# Altium schematic sheet [01] cover page.SchDoc
size A4; Organization: Blinkinlabs, LLC; DocumentNumber: 1; SheetNumber: 1; SheetTotal: 4
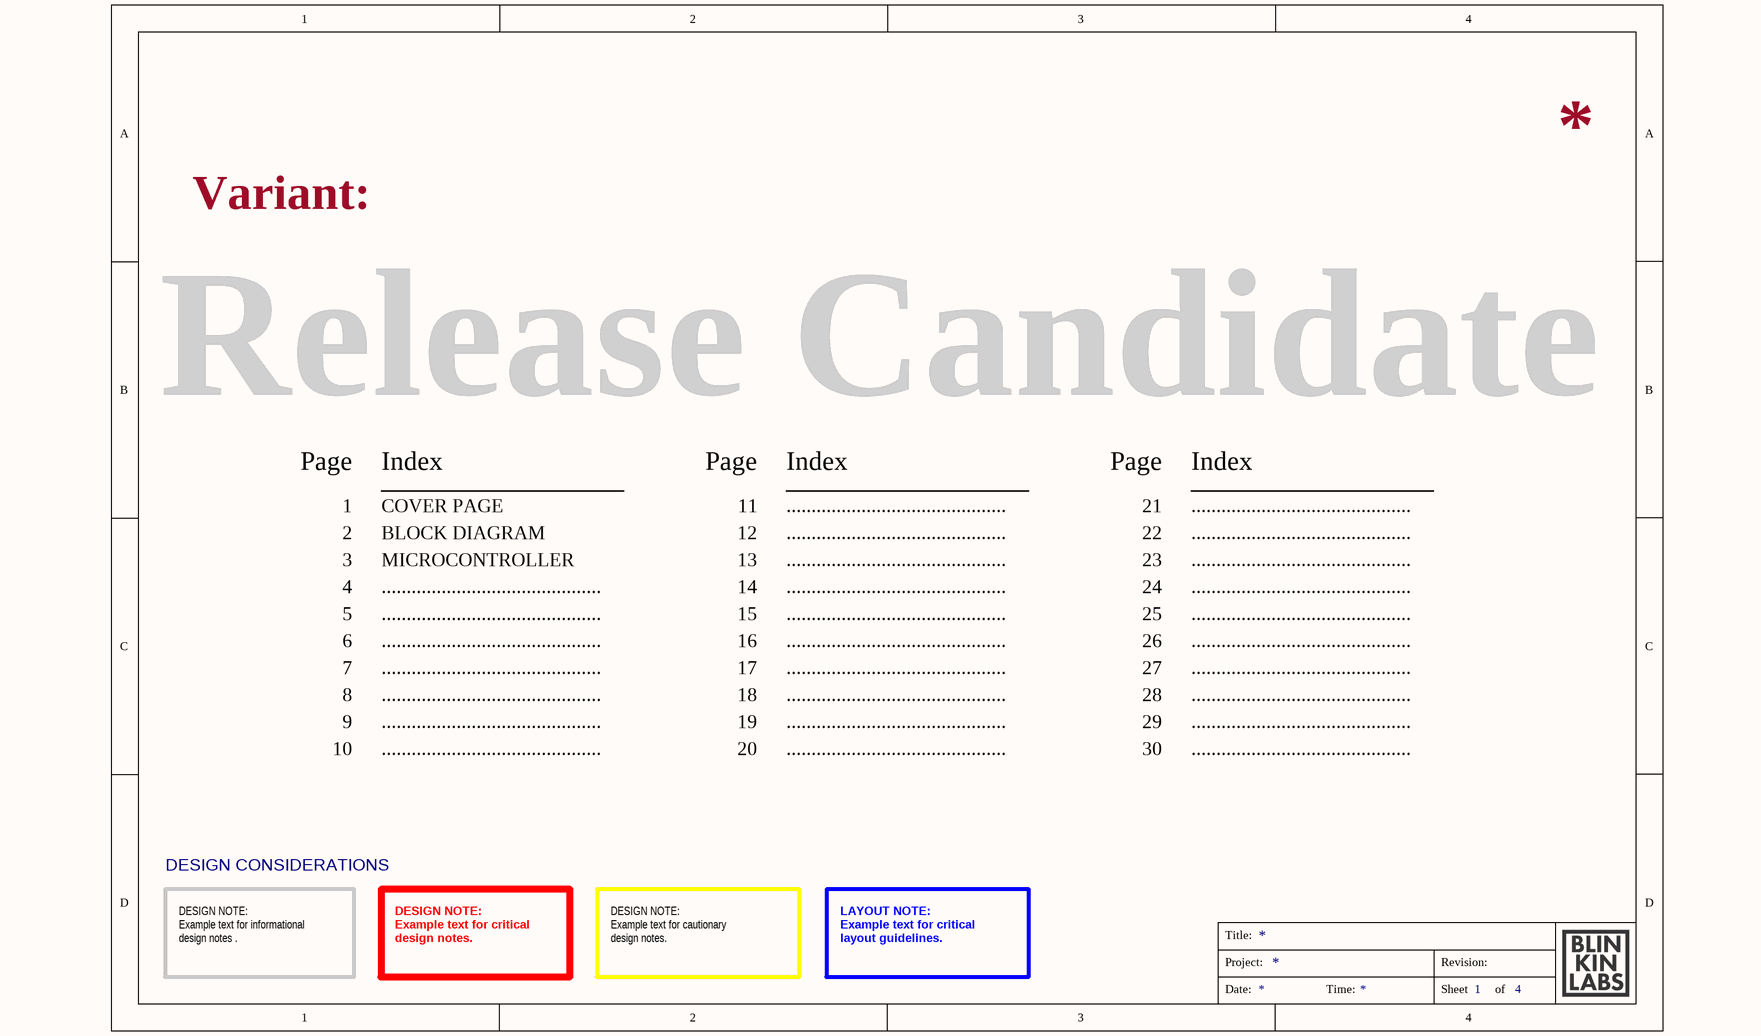
[diagram p0: [01] cover page.SchDoc]

## Notes on the sheet
- Variant:
- Release Candidate
- Page
- 1
- Index
- COVER PAGE
- 11
- ............................................
- 21
- 2
- 3
- BLOCK DIAGRAM
- MICROCONTROLLER
- 12
- 13
- 22
- 23
- 4
- 5
- 6
- 14
- 15
- 16
- 24
- 25
- 26
- 7
- 8
- 17
- 18
- 27
- 28
- 9
- 10
- 19
- 20
- 29
- 30
- DESIGN CONSIDERATIONS
- DESIGN NOTE:
  Example text for informational
  design notes .
- DESIGN NOTE:
  Example text for critical
  design notes.
- DESIGN NOTE:
  Example text for cautionary
  design notes.
- LAYOUT NOTE:
  Example text for critical
  layout guidelines.
- Title:
- Project:
- Revision:
- Date:
- Time:
- Sheet
- of